# EAGLE design controller_board (EAGLE 7.2.0)
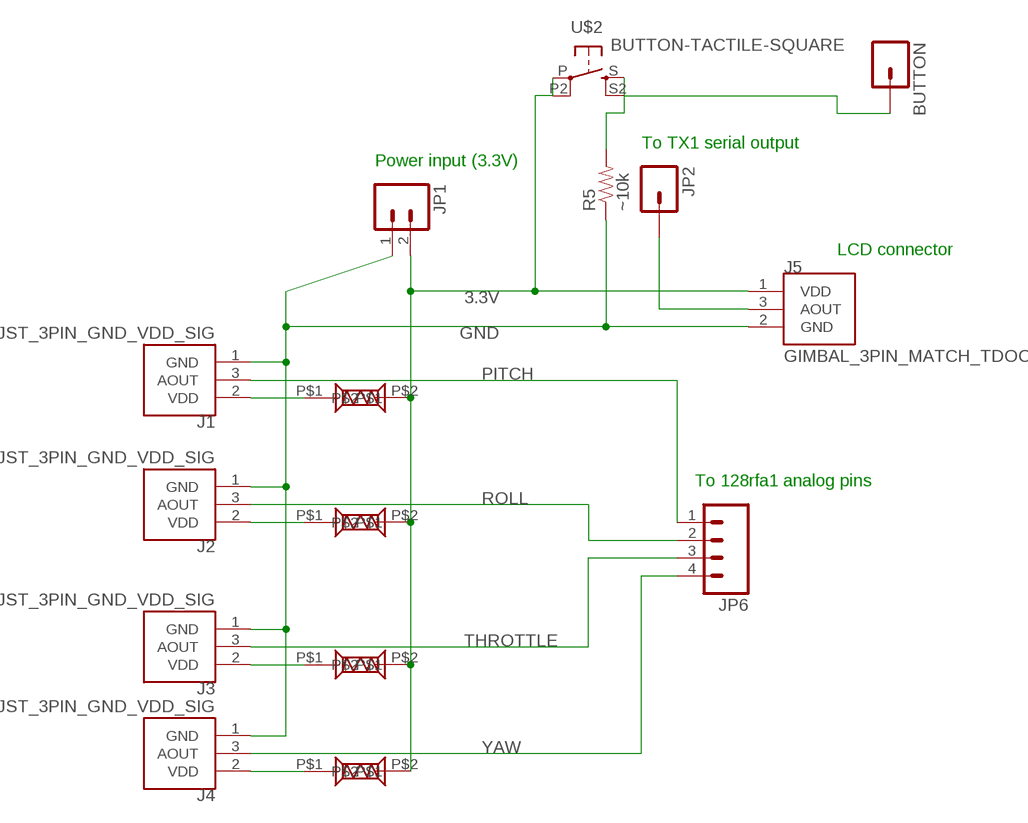
[diagram p0: schematic, sheet 1]

## Parts
BUTTON  M01PTH  [1X01]
J1  JST_3PIN_GND_VDD_SIG  [JST-3-PTH-REVERSE]
J2  JST_3PIN_GND_VDD_SIG  [JST-3-PTH-REVERSE]
J3  JST_3PIN_GND_VDD_SIG  [JST-3-PTH-REVERSE]
J4  JST_3PIN_GND_VDD_SIG  [JST-3-PTH-REVERSE]
J5  GIMBAL_3PIN_MATCH_TDOCU  [JST-3-PTH]
JP1  M021X02_NO_SILK  [1X02_NO_SILK]
JP2  M01PTH  [1X01]
JP6  M04PTH  [1X04]
R  4k  CRF12_RESISTOR  [CRF12_RESISTOR]
R2  2k  CRF12_RESISTOR  [CRF12_RESISTOR]
R3  4k  CRF12_RESISTOR  [CRF12_RESISTOR]
R4  2k  CRF12_RESISTOR  [CRF12_RESISTOR]
R5  ~10k  RESISTORPTH-1/4W  [AXIAL-0.4]
U$2  BUTTON-TACTILE-SQUARE  [BUTTON-TACTILE-SQUARE-ADAFRUIT1010]

## Nets
3.3V: J5.1(VDD) JP1.2 R2.P$2 R3.P$2 R4.P$2 R.P$2 U$2.P U$2.P2(P1)
GND: J1.1(GND) J2.1(GND) J3.1(GND) J4.1(GND) J5.2(GND) JP1.1 R5.P$1
N$1: J1.2(VDD) R.P$1
N$2: J2.2(VDD) R2.P$1
N$3: J4.2(VDD) R4.P$1
N$4: J3.2(VDD) R3.P$1
N$6: BUTTON.1 R5.P$2 U$2.S U$2.S2(S1)
N$9: J5.3(AOUT) JP2.1
PITCH: J1.3(AOUT) JP6.1
ROLL: J2.3(AOUT) JP6.2
THROTTLE: J3.3(AOUT) JP6.3
YAW: J4.3(AOUT) JP6.4

## Notes on the sheet
- To TX1 serial output
- Power input (3.3V)
- LCD connector
- To 128rfa1 analog pins

## Library data of the parts
BUTTON JP2 = SparkFun-Connectors:M01: Header 1 Standard 1-pin 0.1" header. Use with straight break away headers (SKU : PRT-00116), right angle break away headers (PRT-00553), swiss pins (PRT-00743), machine pins (PRT-00117), and female headers (PRT-00115).
J1-J4 = Controller:JST_3PIN_GND_VDD_SIG
J5 = Controller:GIMBAL_3PIN_MATCH_TDOCU
JP1 = SparkFun-Connectors:M02: Standard 2-pin 0.1" header. Use with - straight break away headers ( PRT-00116) - right angle break away headers (PRT-00553) - swiss pins (PRT-00743) - machine pins (PRT-00117) - female headers (PRT-00115) Molex polarized connector foot print use with: PRT-08233 with associated crimp pins and housings. 2.54_SCREWTERM for use with PRT-10571. 3.5mm Screw Terminal footprints for PRT-08084 5mm Screw Terminal footprints for use with PRT-08432
JP6 = SparkFun-Connectors:M04: Header 4 Standard 4-pin 0.1" header. Use with straight break away headers (SKU : PRT-00116), right angle break away headers (PRT-00553), swiss pins (PRT-00743), machine pins (PRT-00117), and female headers (PRT-00115). Molex polarized connector foot print use with SKU : PRT-08231 with associated crimp pins and housings. 1MM SMD Version SKU: PRT-10208
R R2-R4 = Andranik-Lab4:CRF12_RESISTOR
R5 = SparkFun-Resistors:RESISTOR: Resistor Basic schematic elements and footprints for 0603, 1206, and PTH resistors.
U$2 = Controller:BUTTON-TACTILE

## Board
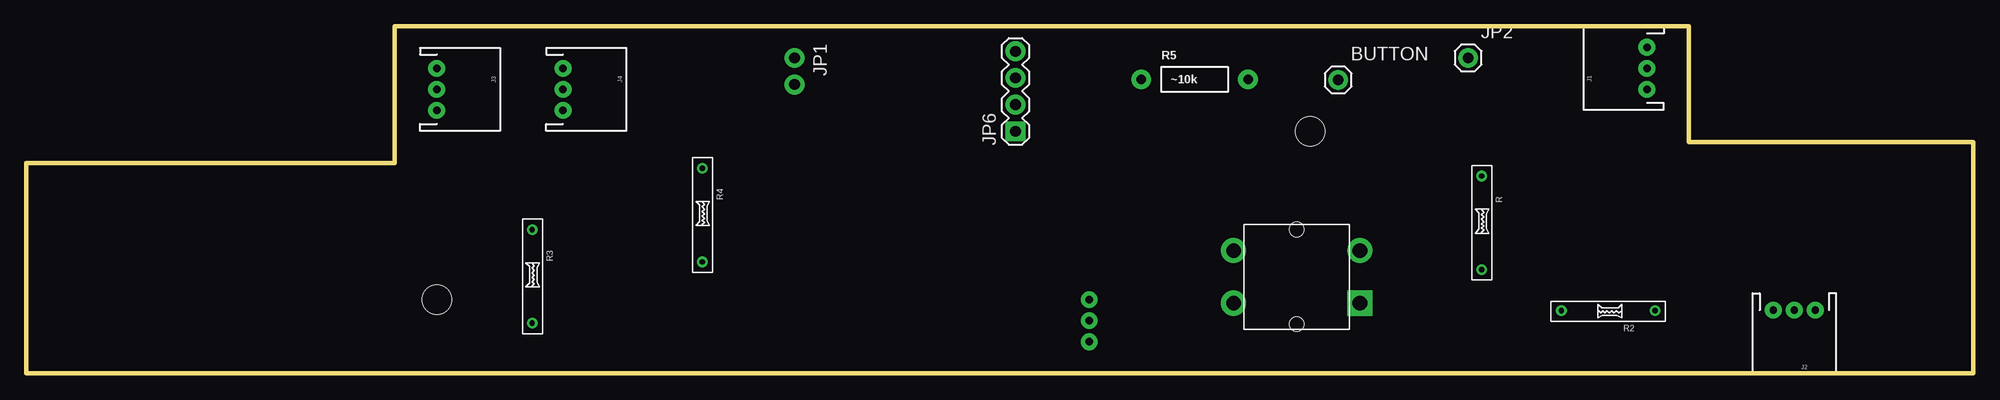
[diagram p1: board, top side]
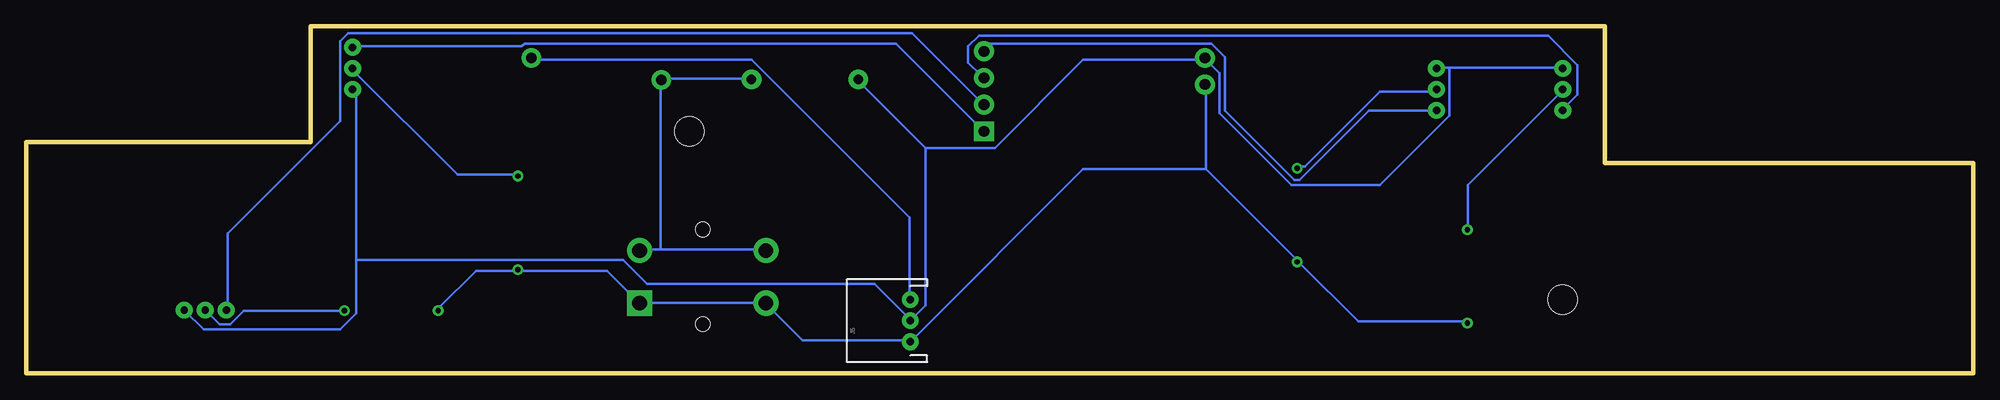
[diagram p2: board, bottom side, seen from below]

Size 185 x 33 mm. Coordinates in mm from the lower left corner, seen from the top.
Outline: 158,22 158,33 35,33 35,20 0,20 0,0 185,0 185,22 158,22
Copper layers (1*16): Top 0.035mm / dielectric 1.5mm / Bottom 0.035mm
Design rules "LPKF": minimum track width 10mil, minimum drill 0.599440625mm, track to track 10mil, track to pad 10mil, pad to pad 10mil, via to via 10mil, smd to smd 1mil, copper to edge 10mil, drill to drill 6mil, minimum pad ring 10mil, minimum via ring 10mil, stop-mask expansion 4mil, vias tented up to drill 0mil, thermal gap 10mil

### Footprints (pad centres in the part's own frame; a part is rotated, then mirrored left to right if it is on the bottom)
1X01 = drill 1.016 pad 1.88: 1 0,0
JST-3-PTH-REVERSE = drill 0.7 pad 1.6: 1 -2,0; 2 0,0; 3 2,0
JST-3-PTH = drill 0.7 pad 1.6: 1 -2,0; 2 0,0; 3 2,0
1X02_NO_SILK = drill 1.016 pad 1.88: 1 0,0; 2 2.54,0
1X04 = drill 1.016 pad 1.88 square: 1 0,0 | drill 1.016 pad 1.88: 2 2.54,0; 3 5.08,0; 4 7.62,0
CRF12_RESISTOR = drill 0.5: P$1 -4.45,0; P$2 4.45,0
AXIAL-0.4 = drill 0.9 pad 1.88: P$1 -5.08,0; P$2 5.08,0
CONNECTOR_BOARD_OUTLINE = hole 2.8: 154,45; 71,29
BUTTON-TACTILE-SQUARE-ADAFRUIT1010 = drill 1.4 square: P -6,2.5 | drill 1.4: P2 6,2.5; S -6,-2.5; S2 6,-2.5 | hole 1.4: 0,-4.5; 0,4.5

### Placement (x,y rotation side)
BUTTON  124.66,27.9 0 top
J1  154,29 90 top
J2  168,6 180 top
J3  39,27 270 top
J4  51,27 270 top
J5  101,5 90 bottom
JP1  73,30 270 top
JP2  137,30 0 top
JP6  94,23 90 top
R  138.28,14.31 270 top
R2  150.31,5.95 180 top
R3  48.07,9.21 270 top
R4  64.23,15.04 270 top
R5  111.01,27.94 0 top
U$1  [CONNECTOR_BOARD_OUTLINE]  -32,-22 0 top
U$2  120.72,9.17 180 top

### Tracks (layer width: path | path; a pad name or v marks a point on that pad's centre or on a via)
3.3V
  Bottom 0.254: R3.P$2 48.26,4.92 58.42,4.92 64.01,10.51 R4.P$2 64.27,10.77 72.9,19.4 | 72.9,19.4 72.9,27.28 JP1.2 | R2.P$2 145.8,6.19 142.24,9.75 138.43,9.75 R.P$2 138.18,9.75 129.8,9.75 126.75,6.7 U$2.P 126.5,6.7 114.81,6.7 U$2.P2 114.56,6.45 111.26,3.15 101.1,3.15 J5.1 100.84,3.15 84.59,19.4 72.9,19.4
GND
  Bottom 0.254: 153.67,10.77 153.67,26.51 153.93,26.77 J1.1 | 153.67,10.77 153.67,5.69 155.2,4.16 168.15,4.16 169.93,5.94 J2.1 | 49.79,29.05 50.8,29.05 J4.1 | 49.79,29.05 39.12,29.05 J3.1 | 99.57,21.43 99.57,6.45 100.84,5.18 J5.2 101.1,5.18 104.4,8.48 125.99,8.48 128.27,10.77 153.67,10.77 | 99.57,21.43 105.92,27.78 R5.P$1 | 99.57,21.43 92.97,21.43 84.59,29.82 73.16,29.82 JP1.1 72.9,29.82 71.63,28.55 71.63,24.74 64.77,17.88 56.39,17.88 49.79,24.48 49.79,29.05
N$1
  Bottom 0.254: R.P$1 138.43,18.89 144.02,18.89 153.93,28.8 J1.2
N$2
  Bottom 0.254: R2.P$1 154.94,5.94 164.34,5.94 165.61,4.67 166.63,4.67 167.9,5.94 J2.2
N$3
  Bottom 0.254: R4.P$1 64.01,19.66 63.5,19.66 56.39,26.77 51.06,26.77 J4.2
N$4
  Bottom 0.254: R3.P$1 48.01,13.81 48.01,17.88 39.12,26.77 J3.2
N$6
  Bottom 0.254: R5.P$2 116.34,28.04 124.46,28.04 BUTTON.1 124.72,27.78 124.72,11.78 | 124.72,11.78 126.5,11.78 U$2.S | 124.72,11.78 114.81,11.78 U$2.S2
N$9
  Bottom 0.254: J5.3 101.1,7.21 101.1,14.83 116.08,29.82 136.91,29.82 JP2.1
PITCH
  Bottom 0.254: J1.3 153.93,31.09 137.93,31.09 137.67,31.34 102.37,31.34 94.24,23.21 JP6.1
ROLL
  Bottom 0.254: J2.3 165.87,6.19 165.87,13.31 155.2,23.97 155.2,31.59 154.44,32.36 100.84,32.36 94.24,25.75 JP6.2
THROTTLE
  Bottom 0.254: J3.3 38.87,25.24 37.6,26.51 37.6,29.31 40.39,32.1 94.49,32.1 95.51,31.09 95.51,29.56 94.24,28.29 JP6.3
YAW
  Bottom 0.254: J4.3 51.06,24.99 57.41,24.99 64.01,18.39 64.52,18.39 71.12,24.99 71.12,30.07 72.39,31.34 93.48,31.34 93.98,30.83 JP6.4